# Altium schematic sheet B38_AMS1117-3V3.SchDoc
size A4; SheetNumber: 3; SheetTotal: 11
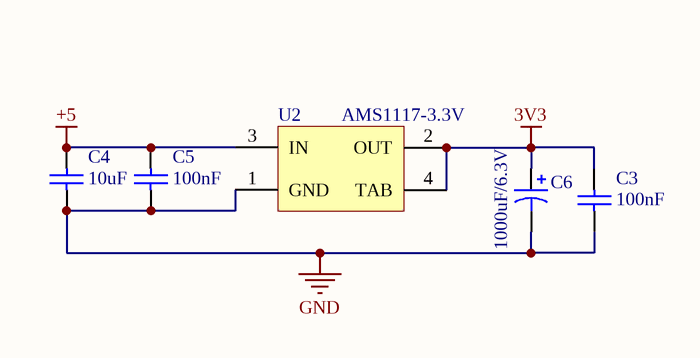
[diagram p0: B38_AMS1117-3V3.SchDoc]

## Parts
C3  100nF  [CAP0603]
C4  10uF  [cap1206]
C5  100nF  [CAP0603]
C6  1000uF/6.3V  [Cap electrolitic radial 8x11.5]
U2  AMS1117-3.3V  [SOT-223]

## Nets
3V3: C3.2 C6.1 U2.2(OUT) U2.4(TAB)
+5: C4.2 C5.2 U2.3(IN)
GND: C3.1 C4.1 C5.1 C6.2 U2.1(GND)

## Library data of the parts
C3-C5 = Cap: Capacitor 6.3V, 10%; Manufacturer: Walsin; PN: 0603X106K6R3
  C3 C5: Value: 100nF
  C4: Value: 10uF
C6 = Cap Pol1: Aluminum electrolytic capacitor  220uF/6.3vV/8*11.5; Value: 1000uF/6.3V
U2 = ASM1117: Low Dropout Linear Regulator , Positive , Fixed , Output Voltage : 3.3V , Output Current : 1A ; Input Voltage :18V; PN: AMS1117-3.3V; Value: AMS1117-3.3V